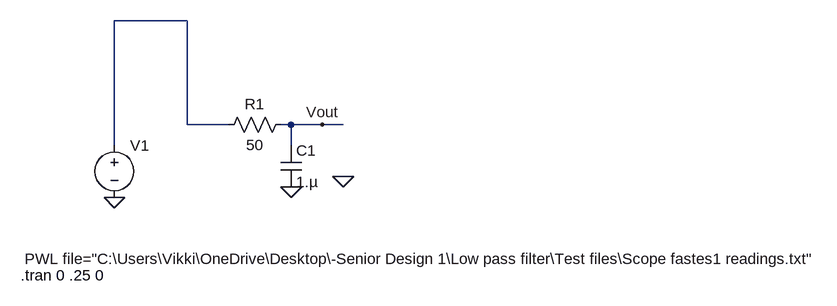
[diagram p0: schematic Low pass filter two.asc]
Low pass filter two.asc, the LTspice schematic file:
Version 4
SHEET 1 1576 680
WIRE 32 -64 -80 -64
WIRE 32 96 32 -64
WIRE 96 96 32 96
WIRE 192 96 176 96
WIRE 240 96 192 96
WIRE 272 96 240 96
WIRE -80 128 -80 -64
WIRE 192 128 192 96
FLAG -80 208 0
FLAG 192 192 0
FLAG 272 176 0
FLAG 240 96 Vout
SYMBOL voltage -80 112 R0
WINDOW 3 -138 191 Left 2
WINDOW 123 0 0 Left 0
WINDOW 39 0 0 Left 0
SYMATTR Value PWL file="C:\Users\Vikki\OneDrive\Desktop\-Senior Design 1\Low pass filter\Test files\Scope fastes1 readings.txt"
SYMATTR InstName V1
SYMBOL res 80 112 R270
WINDOW 0 32 56 VTop 2
WINDOW 3 0 56 VBottom 2
SYMATTR InstName R1
SYMATTR Value 50
SYMBOL cap 176 128 R0
SYMATTR InstName C1
SYMATTR Value 1.µ
TEXT -224 328 Left 2 !.tran 0 .25 0

The netlist it stands for:
* Low pass filter two.asc
V1 N001 0 PWL file="C:\Users\Vikki\OneDrive\Desktop\-Senior Design 1\Low pass filter\Test files\Scope fastes1 readings.txt"
R1 N001 Vout 50
C1 Vout 0 1.µ
.tran 0 .25 0
.backanno
.end